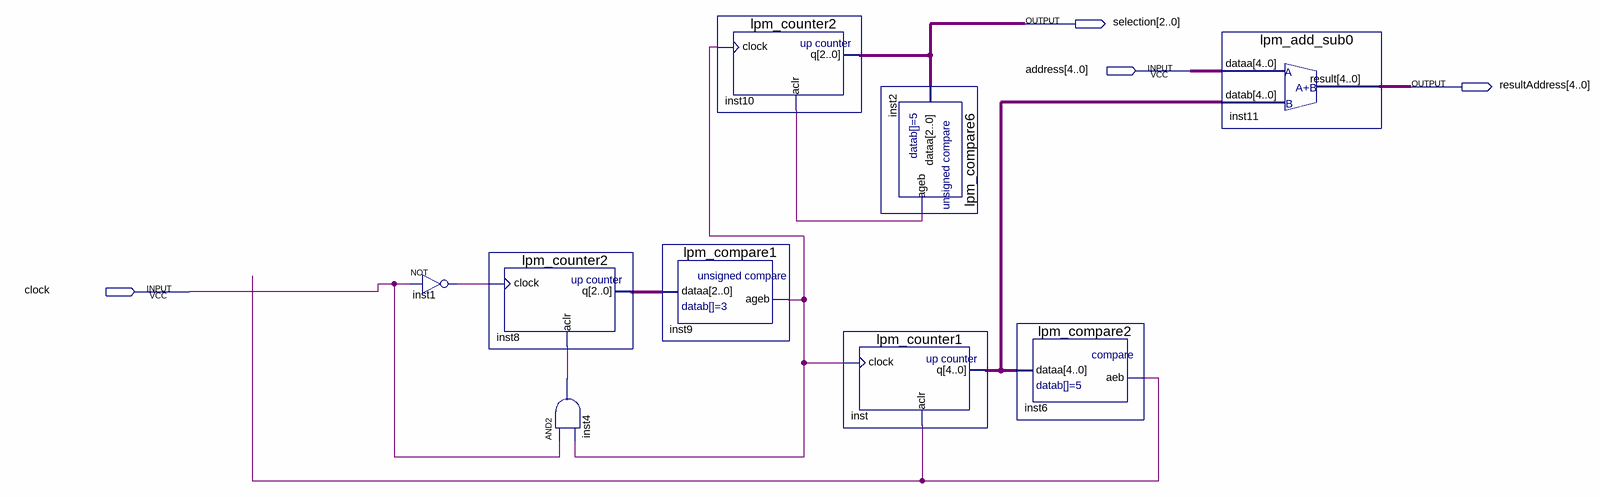
[diagram p0: schematic sheet]
// Quartus schematic address_maneger.bdf as structural Verilog: 9 symbols, 4 pins
module address_maneger (
  input  [4:0] address,
  input  clock,
  output [2:0] selection,
  output [4:0] resultAddress
);

  wire inst1_out, inst2_ageb, inst4_out, inst6_aeb, inst9_ageb;
  wire [2:0] inst8_q;
  wire [4:0] inst_q;

  not inst1 (inst1_out, clock);
  lpm_counter2 inst8 (.clock(inst1_out), .aclr(inst4_out), .q(inst8_q));
  and inst4 (inst4_out, clock, inst9_ageb);
  lpm_counter2 inst10 (.clock(inst9_ageb), .aclr(inst2_ageb), .q(selection));
  lpm_compare1 inst9 (.dataa(inst8_q), .ageb(inst9_ageb));
  lpm_counter1 inst (.clock(inst9_ageb), .aclr(inst6_aeb), .q(inst_q));
  lpm_compare6 inst2 (.dataa(selection), .ageb(inst2_ageb));
  lpm_compare2 inst6 (.dataa(inst_q), .aeb(inst6_aeb));
  lpm_add_sub0 inst11 (.dataa(address), .datab(inst_q), .result(resultAddress));
endmodule
